# Altium project CZ101_V1.0.PrjPCB
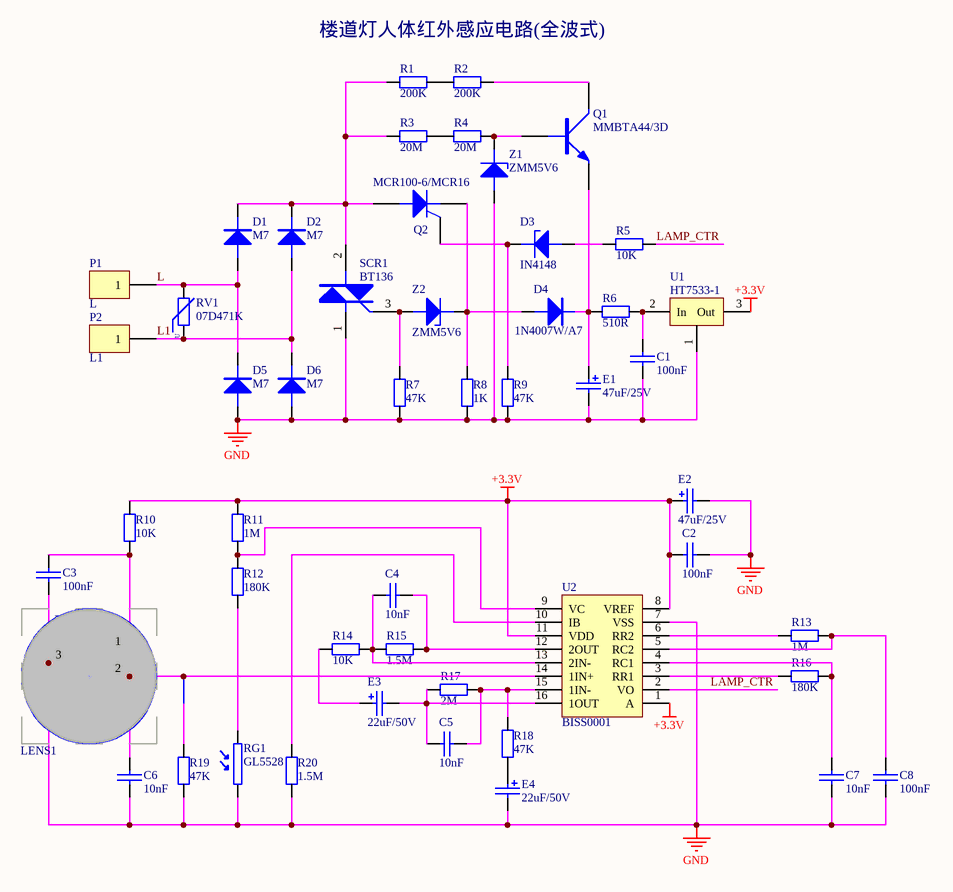
[diagram p0: CZ101_V1.0.SchDoc]
1 sheet, 51 parts. Net scope: global (net labels, ports and power ports of the same name join across sheets).
Board files: CZ101_V1.0.PcbDoc, CZ101_Weld_V1.0.PcbDoc

## Sheet CZ101_V1.0.SchDoc
size A4

### Parts
C1  100nF  [0805_C1]
C2  100nF  [0805_C1]
C3  100nF  [0805_C1]
C4  10nF  [0805_C1]
C5  10nF  [0805_C1]
C6  10nF  [0805_C1]
C7  10nF  [0805_C1]
C8  100nF  [0805_C1]
D1  M7  [DO-214AC(SMA)]
D2  M7  [DO-214AC(SMA)]
D3  IN4148  [LL-34]
D4  1N4007W/A7  [SOD-123]
D5  M7  [DO-214AC(SMA)]
D6  M7  [DO-214AC(SMA)]
E1  47uF/25V  [CS_47uF/25V]
E2  47uF/25V  [CS_47uF/25V]
E3  22uF/50V  [CS_47uF/25V]
E4  22uF/50V  [CS_47uF/25V]
LENS1  Fresnel lens  [Fresnel lens]  (value not drawn)
P1  L  [CP3M*8.8]
P2  L1  [CP3M*8.8]
PRI1  D203S  [D203S]
Q1  MMBTA44/3D  [SOT-23]
Q2  MCR100-6/MCR16  [SOT-23]
R1  200K  [1206_R]
R2  200K  [1206_R]
R3  20M  [0805_R]
R4  20M  [0805_R]
R5  10K  [1206_R]
R6  510R  [0805_R]
R7  47K  [0805_R]
R8  1K  [0805_R]
R9  47K  [0805_R]
R10  10K  [0805_R]
R11  1M  [0805_R]
R12  180K  [0805_R]
R13  1M  [0805_R]
R14  10K  [0805_R]
R15  1.5M  [0805_R]
R16  180K  [0805_R]
R17  2M  [0805_R]
R18  47K  [0805_R]
R19  47K  [0805_R]
R20  1.5M  [0805_R]
RG1  GL5528  [R5537]
RV1  07D471K  [RV-5MM]
SCR1  BT136  [TO-252]
U1  HT7533-1  [SOT-89]
U2  BISS0001  [SO-16]
Z1  ZMM5V6  [LL-34]
Z2  ZMM5V6  [LL-34]

### Nets
+3.3V: C2.1 E2.1 R10.2 R11.2 U1.3(Out) U2.1(A) U2.8(VREF) U2.11(VDD)
GND: C1.2 C2.2 C3.2 C6.2 C7.2 C8.1 D5.A D6.A E1.2 E2.2 E4.2 PRI1.3(G) R7.1 R8.1 R9.1 R19.1 R20.1 RG1.1 SCR1.1(T) U1.1(GND) U2.7(VSS) Z1.A
L: D1.A D5.K P1.1 RV1.2
L1: D2.A D6.K P2.1 RV1.1
LAMP_CTR: R5.2 U2.2(VO)
NetC1_1: C1.1 R6.2 U1.2(In)
NetC3_1: C3.1 PRI1.1(D) R10.1
NetC4_1: C4.1 R14.2 R15.1 U2.13(2IN-)
NetC4_2: C4.2 R15.2 U2.12(2OUT)
NetC5_1: C5.1 R17.2 R18.2 U2.15(1IN-)
NetC5_2: C5.2 E3.2 R17.1 U2.16(1OUT)
NetC6_1: C6.1 PRI1.2(S) R19.2 U2.14(1IN+)
NetC7_1: C7.1 R16.1 U2.4(RC1)
NetC8_2: C8.2 R13.2 U2.5(RC2)
NetD1_K: D1.K D2.K Q2.3(A) R1.1 R3.1 SCR1.2(T)
NetD3_A: D3.A R5.1
NetD3_K: D3.K Q2.2(G) R9.2
NetD4_A: D4.A Q2.1(K) R8.2 Z2.K
NetD4_K: D4.K E1.1 Q1.2(E) R6.1
NetE3_1: E3.1 R14.1
NetE4_1: E4.1 R18.1
NetQ1_1: Q1.1(B) R4.2 Z1.K
NetQ1_3: Q1.3(C) R2.2
NetR1_2: R1.2 R2.1
NetR3_2: R3.2 R4.1
NetR7_2: R7.2 SCR1.3(G) Z2.A
NetR11_1: R11.1 R12.2 U2.9(VC)
NetR12_1: R12.1 RG1.2
NetR13_1: R13.1 U2.6(RR2)
NetR16_2: R16.2 U2.3(RR1)
NetR20_2: R20.2 U2.10(IB)

### Notes on the sheet
- 楼道灯人体红外感应电路(全波式)
- (in symbol Res Piezo Varistor) U

### Library data of the parts
C1-C8 = Cap1
D1 D2 D4-D6 = Diode-A: SS14,SS24,SS34,M7
D3 Z1 Z2 = Diode-B
E1-E4 = Cap Pol1: CS_100uF/16V: D=5mm , PIN Spacing= 2mm; CS_1000uF/16V: D=10mm , PIN Spacing= 3.5mm; CS_470uF/16V: D=8mm , PIN Spacing= 3.5mm; CS_100uF/25V: D=6.3mm , PIN Spacing= 2.5mm; CS_470uF/25V: D=10mm , PIN Spacing= 3.5mm; CS_1000uF/25V: D=10mm , PIN Spacing= 3.5mm; CS_220uF/25V: D=8mm , PIN Spacing= 3.5mm; CS_220uF/16V: D=6.3mm , PIN Spacing= 2.5mm; CS_47uF/25V: D=5mm , PIN Spacing= 2mm
P1 P2 = Header 1: Header, 1-Pin; LatestRevisionDate: 17-Jul-2002; LatestRevisionNote: Re-released for DXP Platform.; Publisher: Altium Limited
PRI1 = D203S: D203S, KP500BP
Q1 = 8050
Q2 = MCR100-8: Silicon Controlled Rectifier; Published: 8-Jun-2000; LatestRevisionDate: 17-Jul-2002; LatestRevisionNote: Re-released for DXP Platform.; PackageReference: TO-220-AB; Publisher: Altium Limited; Code_JEDEC: TO-220-AB
R1-R20 = Res1: Name: Resistor; Power: 0210(1/20W 25V), 0402(1/16W  50V),0603(1/16W  50V),0805(1/10W  150V),1206(1/8W  200V),1210(1/4W  200V),1812(1/2W  200V),2010(1/2W  200V),2512(1W  200V),
RG1 = GL5539
RV1 = Res Piezo Varistor
SCR1 = TRIAC
U1 = HT7833: HT7533; Output 500mA; Iq: 5uA, max= 7uA
U2 = BISS0001: BISS0001, CSC0001